# EAGLE design X16R60 (EAGLE 9.6.2)
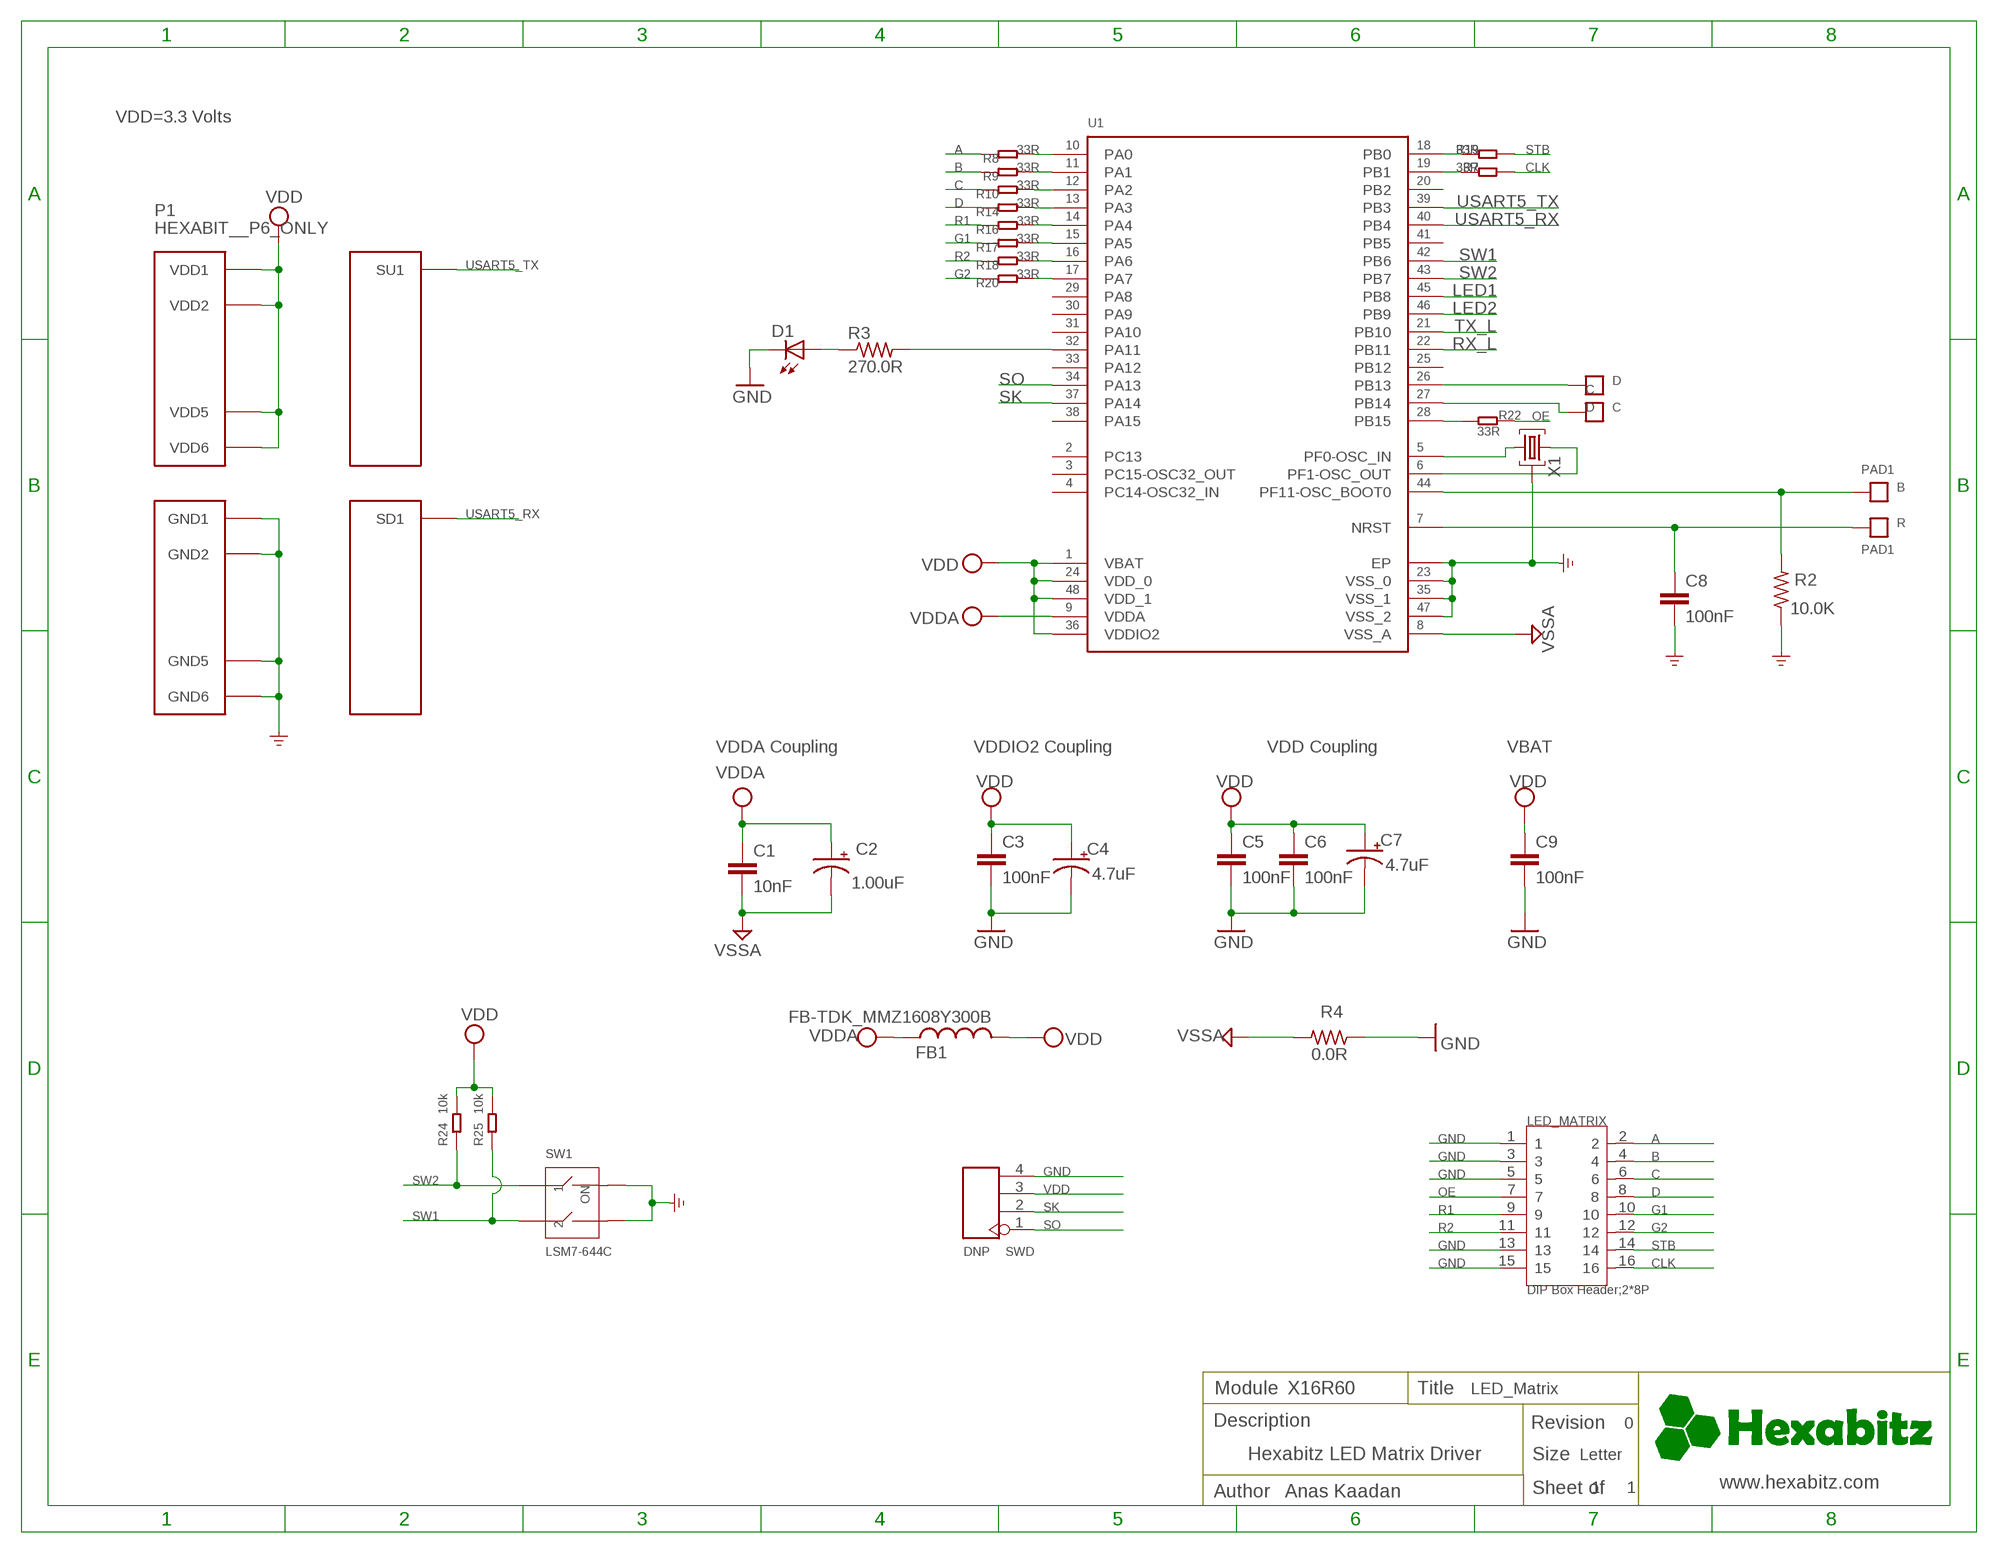
[diagram p0: schematic, sheet 1]

## Parts
B  PAD1  [PAD1]
C  C  PAD1  [PAD1]
C1  10nF  C-0603  [C-0603]
C2  1.00uF  C-0805-POL  [C-0805-POL]
C3  100nF  C-0603  [C-0603]
C4  4.7uF  C-0805-POL  [C-0805-POL]
C5  100nF  C-0603  [C-0603]
C6  100nF  C-0603  [C-0603]
C7  4.7uF  C-0805-POL  [C-0805-POL]
C8  100nF  C-0603  [C-0603]
C9  100nF  C-0603  [C-0603]
D  D  PAD1  [PAD1]
D1  VLMS1300-GS08  [VLMS1300-GS08]
FB1  FB-TDK_MMZ1608Y300B  [FB-TDK_MMZ1608Y300B]
LED_MATRIX  DIP Box Header;2*8P  HEADER-2X8P  [H2X8_2.54]
P1  HEXABIT__P6_ONLY  [HEXABIT_17.32_P6_ONLY]
R  PAD1  [PAD1]
R2  10.0K  R-0603  [R-0603]
R3  270.0R  R-0603  [R-0603]
R4  0.0R  R-0603  [R-0603]
R7  33R  RES-0402  [R0402]
R8  33R  RES-0402  [R0402]
R9  33R  RES-0402  [R0402]
R10  33R  RES-0402  [R0402]
R14  33R  RES-0402  [R0402]
R16  33R  RES-0402  [R0402]
R17  33R  RES-0402  [R0402]
R18  33R  RES-0402  [R0402]
R19  33R  RES-0402  [R0402]
R20  33R  RES-0402  [R0402]
R22  33R  RES-0402  [R0402]
R24  10k  RES-0402  [R0402]
R25  10k  RES-0402  [R0402]
SW1  LSM7-644C  SWITCHES-2X2P'KM-02'  [SW4-SMD-2.54-5.08X6.8X3.3MM]
SWD  DNP  HEADER-4P-65/35MIL  [H4-2.54]
U1  STM32F091CBU6  [STM32F091CBU6]
X1  XTALL_CSTCE8M00G52  [XTALL_CSTCE8M00G52]

## Nets
A: LED_MATRIX.2 R8.1
B: LED_MATRIX.4 R9.1
B1: B.P$1 B.P$2 R2.2 U1.P$44(PF11-OSC_BOOT0)
C: LED_MATRIX.6 R10.1
CLK: LED_MATRIX.16 R7.2
D: LED_MATRIX.8 R14.1
G1: LED_MATRIX.10 R17.1
G2: LED_MATRIX.12 R20.2
GND: C3.2 C4.2(-) C5.2 C6.2 C7.2(-) C8.2 C9.2 D1.C LED_MATRIX.1 LED_MATRIX.3 LED_MATRIX.5 LED_MATRIX.13 LED_MATRIX.15 P1.PAD_PD8(GND1) P1.PAD_PD9(GND2) P1.PAD_PD10(GND5) P1.PAD_PD11(GND6) R2.1 R4.1 SW1.3 SW1.4 SWD.4 U1.EP U1.P$23(VSS_0) U1.P$35(VSS_1) U1.P$47(VSS_2) X1.P$2 ; supply symbol labelled GND_POWER
LED1: U1.P$45(PB8)
LED2: U1.P$46(PB9)
N$1: U1.P$5(PF0-OSC_IN) X1.P$1
N$2: R14.2 U1.P$13(PA3)
N$3: R8.2 U1.P$10(PA0)
N$4: U1.P$6(PF1-OSC_OUT) X1.P$3
N$6: R16.2 U1.P$14(PA4)
N$7: R17.2 U1.P$15(PA5)
N$8: R18.2 U1.P$16(PA6)
N$9: R9.2 U1.P$11(PA1)
N$10: R10.2 U1.P$12(PA2)
N$11: R20.1 U1.P$17(PA7)
N$12: R19.1 U1.P$18(PB0)
N$14: D1.A R3.1
N$15: R22.1 U1.P$28(PB15)
N$16: R3.2 U1.P$32(PA11)
N$18: D.P$1 D.P$2 U1.P$26(PB13)
N$19: C.P$1 C.P$2 U1.P$27(PB14)
N$21: R7.1 U1.P$19(PB1)
OE: LED_MATRIX.7 R22.2
R1: LED_MATRIX.9 R16.1
R2: LED_MATRIX.11 R18.1
R3: C8.1 R.P$1 R.P$2 U1.P$7(NRST)
RX_L: U1.P$22(PB11)
SK: SWD.2 U1.P$37(PA14)
SO: SWD.1 U1.P$34(PA13)
STB: LED_MATRIX.14 R19.2
SW1: R25.1 SW1.2 U1.P$42(PB6)
SW2: R24.1 SW1.1 U1.P$43(PB7)
TX_L: U1.P$21(PB10)
USART5_RX: P1.PAD_PD3(SD1) U1.P$40(PB4)
USART5_TX: P1.PAD_PU3(SU1) U1.P$39(PB3)
VDD: C3.1 C4.1(+) C5.1 C6.1 C7.1(+) C9.1 FB1.2 P1.PAD_PU8(VDD1) P1.PAD_PU9(VDD2) P1.PAD_PU10(VDD5) P1.PAD_PU11(VDD6) R24.2 R25.2 SWD.3 U1.P$1(VBAT) U1.P$24(VDD_0) U1.P$36(VDDIO2) U1.P$48(VDD_1)
VDDA: C1.1 C2.1(+) FB1.1 U1.P$9(VDDA)
VSSA: C1.2 C2.2(-) R4.2 U1.P$8(VSS_A)
Unconnected: U1.P$2(PC13) U1.P$3(PC14-OSC32_IN) U1.P$4(PC15-OSC32_OUT) U1.P$20(PB2) U1.P$25(PB12) U1.P$29(PA8) U1.P$30(PA9) U1.P$31(PA10) U1.P$33(PA12) U1.P$38(PA15) U1.P$41(PB5)

## Notes on the sheet
- VDD=3.3 Volts
- VDDA Coupling | VDDIO2 Coupling | VDD Coupling | VBAT
- Module | X16R60 | Title | LED_Matrix
- Description | Revision | 0
- Hexabitz LED Matrix Driver
- Size | Letter
- 1 | 1 | www.hexabitz.com
- Author | Anas Kaadan | Sheet of

## Library data of the parts
B C D R = Hexabitz:PAD1
C1 = Hexabitz:C-0603: CAP CER 10% X7R 0603; CAPACITANCE: 10nF; MFN: KEMET; MPN: C0603C103K5RACTU; OCTOPART_URL: https://octopart.com/c0603c103k5ractu-kemet-133094?r=sp&s=R_iPBxLnSmGqhkU2rIMFpg; TOLERANCE: 10%; VOLTAGE_RATING: 50V
C2 = Hexabitz:C-0805-POL: Cap Tant Solid SMD 2012; CAPACITANCE: 1.00uF; MFN: Yageo; MPN: CC0805KKX7R7BB105; OCTOPART_URL: https://octopart.com/cc0805kkx7r7bb105-yageo-8376555?r=sp&s=YKl1wwtkROau_X5nniH2ig; TOLERANCE: 10%; VOLTAGE_RATING: 16V
C3 C6 C8 = Hexabitz:C-0603: CAP CER 10% X7R 0603; CAPACITANCE: 100nF; MFN: KEMET; MPN: C0603C104K8RACTU; OCTOPART_URL: https://octopart.com/c0603c104k8ractu-kemet-145075?r=sp&s=9bS9ASSwSEqMCE9KBEQZ0g; TOLERANCE: 10%; VOLTAGE_RATING: 10V
C4 C7 = Hexabitz:C-0805-POL: Cap Tant Solid SMD 2012; CAPACITANCE: 4.7uF; MFN: Murata; MPN: GRM21BC81E475KA12L; OCTOPART_URL: https://octopart.com/grm21bc81e475ka12l-murata-10331911?r=sp&s=RY3qZSD8T6mG6TC9CHI5qQ; TOLERANCE: 10%; VOLTAGE_RATING: 25V
C5 = Hexabitz:C-0603: CAP CER 10% X7R 0603; CAPACITANCE: 100nF; MFN: KEMET; MPN: C0603C104K8RACTU; OCTOPART_URL: https://octopart.com/c0603c104k8ractu-kemet-145075?r=sp&s=9bS9ASSwSEqMCE9KBEQZ0g; TOLERANCE: 10%; VOLTAGE_RATING: 10
C9 = Hexabitz:C-0603: CAP CER 10% X7R 0603; CAPACITANCE: 100nF; MFN: KEMET; MPN: C0603C104K8RACTU; OCTOPART_URL: https://octopart.com/c0603c104k8ractu-kemet-145075?r=sp&s=9bS9ASSwSEqMCE9KBEQZ0g; TOLERANCE: 10V; VOLTAGE_RATING: 10%
D1 = Hexabitz:VLMS1300-GS08: Red 0603 130° Clear 54 mcd 2 V Surface Mount ChipLED ; Octopart Url : http://octopart.com/vlms1300-gs08-vishay-21709201; MFN: Vishay; MPN: VLMS1300-GS08; OCTOPART_URL: https://octopart.com/vlms1300-gs08-vishay-21709201?r=sp&s=_gcP4_q8T1SC6PJQPTQ9yA
FB1 = Hexabitz:FB-TDK_MMZ1608Y300B: Ferrite Beads Multi-Layer 30Ohm 25% 100MHz 1.5A 50mOhm DCR 0603; MFN: TDK; MPN: MMZ1608Y300B; OCTOPART_URL: https://octopart.com/mmz1608y300b-tdk-368280?r=sp&s=cd9_2ZEqQ9q9UNBuQgHAiA
LED_MATRIX = Connector-new:HEADER-2X8P; DESCRIPTION: 2.54mm Straight 2X8p 16pin Box Header; MFN: ZYSZ Industry Co., Ltd; PART_URL: https://zyszconn.en.made-in-china.com/product/KjZQvOoUedkq/China-Factory-Supply-2-54mm-Straight-2X8p-16pin-Box-Header.html
P1 = hexabitz_connectors:HEXABIT_?_P6_ONLY: Hexabitz Hexagon Module Connector Hexagon side length = 17.32mm.
R2 = Hexabitz:R-0603: Thick Film Resistors - SMD 0603; MFN: Yageo; MPN: RC0603JR-0710KL; OCTOPART_URL: https://octopart.com/search?q=RC0603JR-0710KL&start=0; RESISTANCE: 10.0K Ohm; TOLERANCE: 5%
R3 = Hexabitz:R-0603: Thick Film Resistors - SMD 0603; MFN: Yageo; MPN: RC0603FR-07270RL; OCTOPART_URL: https://octopart.com/search?q=RC0603FR-07270RL&start=0; RESISTANCE: 270.0 Ohm; TOLERANCE: 1%
R4 = Hexabitz:R-0603: Thick Film Resistors - SMD 0603; MFN: Yageo; MPN: RC0603JR-070RL; OCTOPART_URL: https://octopart.com/rc0603jr-070rl-yageo-1241539?r=sp&s=X2NteqRjRNWrnx42Y0aliA; RESISTANCE: 0.0 Ohm
R7-R10 R14 R16-R19 R22 = Discrete-new:RES; DESCRIPTION: Res Thick Film 0402 33 Ohm 1% 0.063W(1/16W) ±100ppm/C Pad SMD Automotive T/R; MFN: Yageo; MPN: AC0402FR-0733RL; OCTOPART_URL: https://octopart.com/ac0402fr-0733rl-yageo-24618175?r=sp
R20 = Discrete-new:RES; DESCROPTION: Res Thick Film 0402 33 Ohm 1% 0.063W(1/16W) ±100ppm/C Pad SMD Automotive T/R; MFN: Yageo; MPN: AC0402FR-0733RL; OCTOPART_URL: https://octopart.com/ac0402fr-0733rl-yageo-24618175?r=sp
R24 = Discrete-new:RES; DESCRITION: General Purpose Chip Resistor Thick Film 0402 510kOhm 1% Paper T/R; MFN: Yageo; MPN: RC0402FR-07510KL; OCTOPART_URL: https://octopart.com/rc0402fr-07510kl-yageo-39852933?r=sp
R25 = Discrete-new:RES; DESCRIPTION: General Purpose Chip Resistor Thick Film 0402 510kOhm 1% Paper T/R; MFN: Yageo; MPN: RC0402FR-07510KL; OCTOPART_URL: https://octopart.com/rc0402fr-07510kl-yageo-39852933?r=sp
SW1 = Discrete-new:SWITCHES-2X2P; DESCRIPTION: Switch DIP OFF ON SPST 2 Raised Slide 0.025A 24VDC Gull Wing 2.54mm SMD T/R; MFN: E-Switch; MPN: KAE02LGGR; OCTOPART_URL: https://octopart.com/kae02lggr-e-switch-24959047?r=sp
SWD = Connector-new:HEADER-4P
U1 = HEXABITZ_ICs:STM32F091CBU6: Description : ARM-based 32-bit MCU, CAN, 12 timers, ADC, DAC & Comm. Interface, 2 to 3.6 V, -40 to 85 degC, 48-Pin UFQFPN, RoHS, Tray ;Parameter : Ciiva URL : https://ciiva.com/part/STM32F091CBU6-20240708, CiivaID : 20240708, Clock Speed : 48000000.0 Hz, Lifecycle Status : Active, Mounting Style : Surface Mount, Number of Pins : 48, Octopart Url : https://octopart.com/stm32f091cbu6-stmicroelectronics-51988677, OctopartID : 5f4f955c32ec8088, RAM Memory Size : 32768 B, REACH SVHC Compliance : No SVHC, RoHS : Compliant,; MFN: STMicroelectronics; MPN: STM32F091CBU6; OCTOPART_URL: https://octopart.com/stm32f091cbu6-stmicroelectronics-51988677?r=sp&s=bU6fpgsrTZOxHyt7jkfh3w
X1 = HEXABITZ_OTHER_PARTS:XTALL_CSTCE8M00G52: MURATA CSTCE8M00G52-R0 RESONATOR, SMD, 8MHZ ; Octopart Url : https://octopart.com/cstce8m00g52-r0-murata-7145559; MFN: Murata; MPN: CSTCE8M00G52Z-R0; OCTOPART_URL: https://octopart.com/cstce8m00g52z-r0-murata-17755941?r=sp&s=JDnNJnrHQhyS8Zk4ofFWXw

## Board
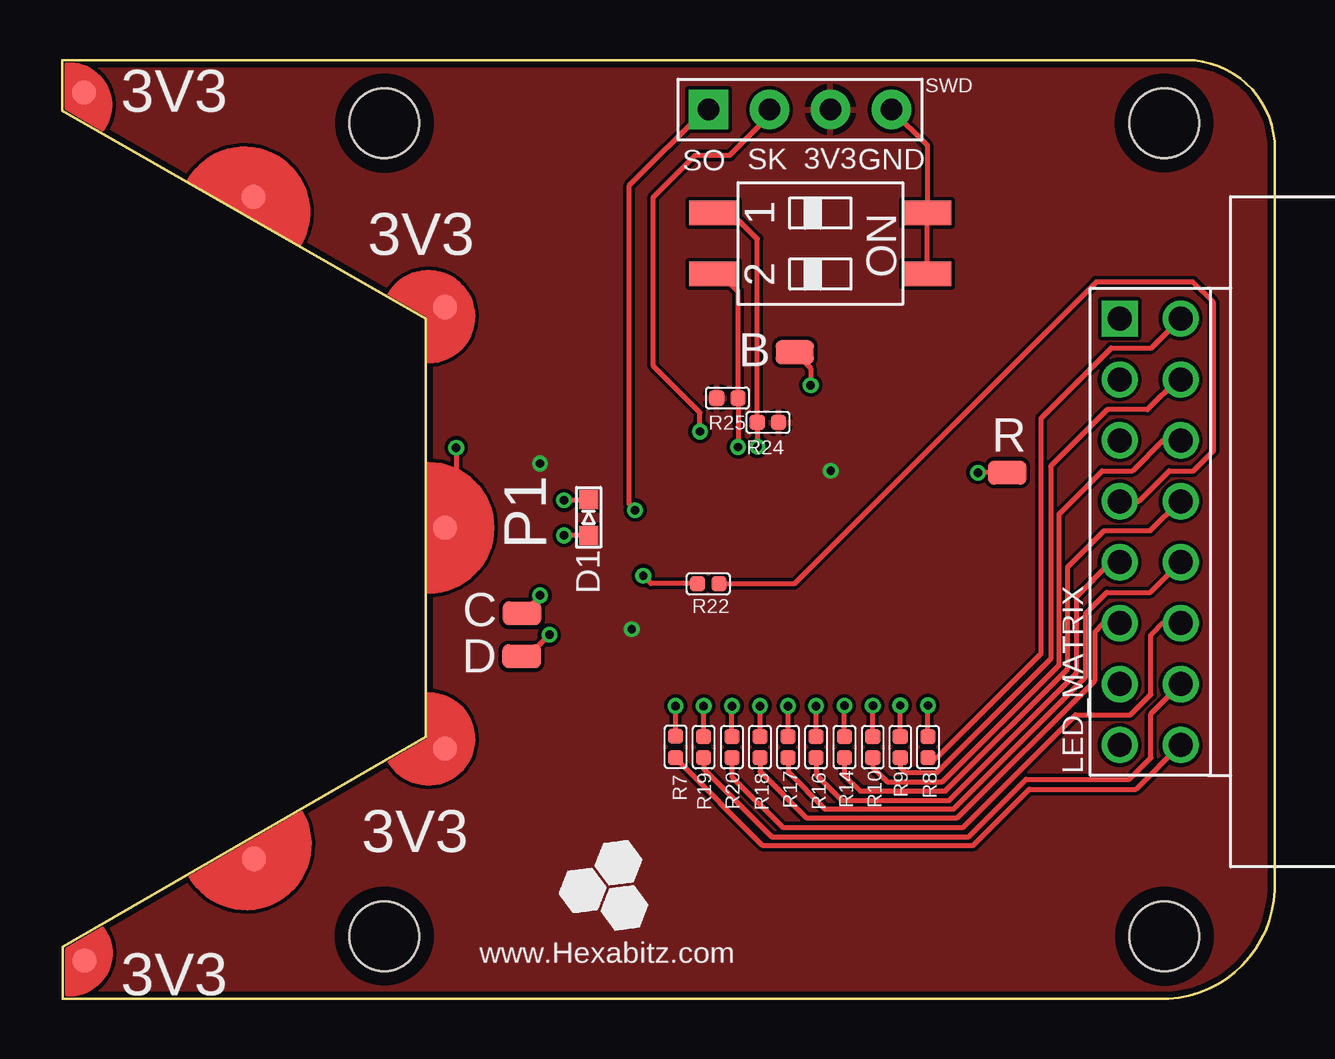
[diagram p1: board, top side]
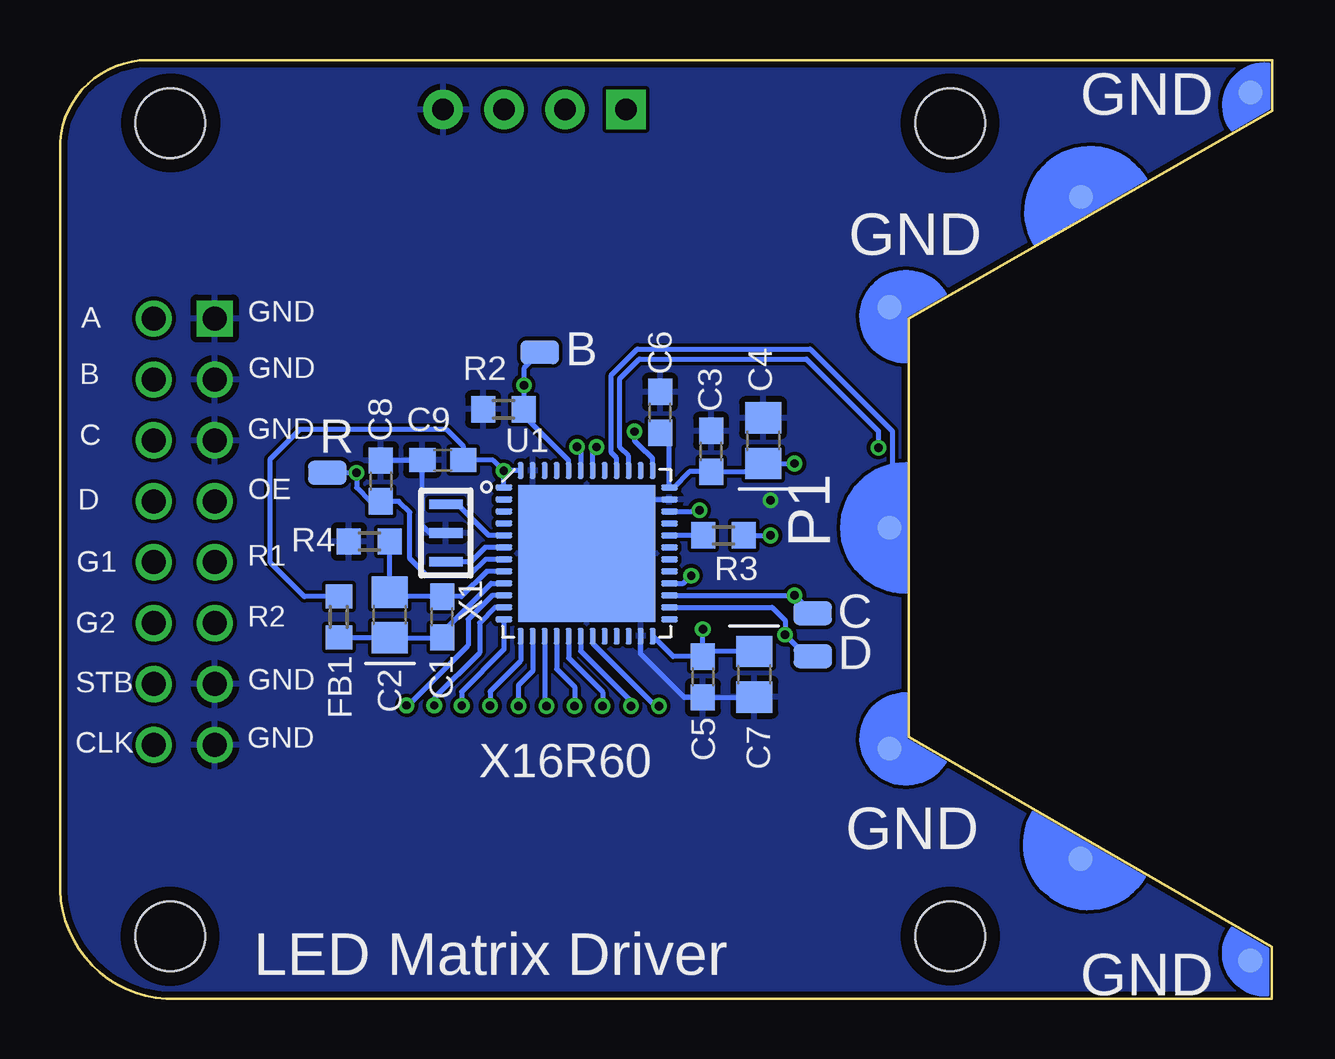
[diagram p2: board, bottom side, seen from below]

Size 50.51 x 39.14 mm. Coordinates in mm from the lower left corner, seen from the top.
Copper layers (1*16): Top 0.035mm / dielectric 1.5mm / Bottom 0.035mm
Design rules "SeeedStudio_2layer_DRU_no_angle_20140221 *": minimum track width 6mil, minimum drill 10mil, track to track 6mil, track to pad 6mil, pad to pad 6mil, via to via 6mil, smd to smd 0mil, copper to edge 10mil, drill to drill 10mil, minimum pad ring 10mil, minimum via ring 6mil, stop-mask expansion 2mil, vias tented up to drill 25mil, thermal gap 10mil
Holes 2.9 mm at 13.41,36.51 13.41,2.6 45.92,2.6 45.92,36.51
tRestrict: area 11.6,34.7 to 15.3,38.3; area 11.6,0.8 to 15.2,4.5; area 44.1,34.7 to 47.7,38.3; area 44.1,0.8 to 47.8,4.4
bRestrict: area 11.6,34.7 to 15.3,38.3; area 11.6,0.8 to 15.2,4.5; area 44.1,34.7 to 47.7,38.3; area 44.1,0.8 to 47.8,4.4

### Footprints (pad centres in the part's own frame; a part is rotated, then mirrored left to right if it is on the bottom)
PAD1 = smd 1.6 x 1: P$1 0,0 | smd 1.6 x 1 bottom: P$2 0,0
C-0603 = smd 1.1 x 1: 1 -0.85,0; 2 0.85,0
C-0805-POL = smd 1.3 x 1.5: 1 -0.95,0; 2 0.95,0
VLMS1300-GS08 = smd 0.8 x 0.8: A 0,0.75; C 0,-0.75
FB-TDK_MMZ1608Y300B = smd 1 x 1.1: 1 -0.85,0; 2 0.85,0
H2X8_2.54 = drill 1 square: 1 -1.27,8.89 | drill 1: 2 1.27,8.89; 3 -1.27,6.35; 4 1.27,6.35; 5 -1.27,3.81; 6 1.27,3.81; 7 -1.27,1.27; 8 1.27,1.27; 9 -1.27,-1.27; 10 1.27,-1.27; 11 -1.27,-3.81; 12 1.27,-3.81; 13 -1.27,-6.35; 14 1.27,-6.35; 15 -1.27,-8.89; 16 1.27,-8.89
HEXABIT_17.32_P6_ONLY = smd 1 x 1 bottom: PAD_PD2 -13.011,14.245; PAD_PD3 -5.034,0.445; PAD_PD4 -12.991,-13.355; PAD_PD8 -20.079,18.59; PAD_PD9 -5.034,9.645; PAD_PD10 -5.034,-8.755; PAD_PD11 -20.066,-17.587 | smd 1 x 1: PAD_PU2 -13.011,14.245; PAD_PU3 -5.034,0.445; PAD_PU4 -12.991,-13.355; PAD_PU8 -20.079,18.59; PAD_PU9 -5.034,9.645; PAD_PU10 -5.034,-8.755; PAD_PU11 -20.066,-17.587
R-0603 = smd 1 x 1.1: 1 -0.85,0; 2 0.85,0
R0402 = smd 0.635 x 0.635: 1 0,0.445; 2 0,-0.445
SW4-SMD-2.54-5.08X6.8X3.3MM = smd 1.016 x 2.032: 1 -1.27,-4.445; 2 1.27,-4.445; 3 1.27,4.445; 4 -1.27,4.445
H4-2.54 = drill 0.889 pad 1.651 square: 1 0,3.81 | drill 0.889 pad 1.651: 2 0,1.27; 3 0,-1.27; 4 0,-3.81
STM32F091CBU6 = smd 5.7 x 5.7: EP 0,0 | smd 0.25 x 0.7: P$1 -2.75,-3.45; P$2 -2.25,-3.45; P$3 -1.75,-3.45; P$4 -1.25,-3.45; P$5 -0.75,-3.45; P$6 -0.25,-3.45; P$7 0.25,-3.45; P$8 0.75,-3.45; P$9 1.25,-3.45; P$10 1.75,-3.45; P$11 2.25,-3.45; P$12 2.75,-3.45; P$25 2.75,3.45; P$26 2.25,3.45; P$27 1.75,3.45; P$28 1.25,3.45; P$29 0.75,3.45; P$30 0.25,3.45; P$31 -0.25,3.45; P$32 -0.75,3.45; P$33 -1.25,3.45; P$34 -1.75,3.45; P$35 -2.25,3.45; P$36 -2.75,3.45 | smd 0.7 x 0.25: P$13 3.45,-2.75; P$14 3.45,-2.25; P$15 3.45,-1.75; P$16 3.45,-1.25; P$17 3.45,-0.75; P$18 3.45,-0.25; P$19 3.45,0.25; P$20 3.45,0.75; P$21 3.45,1.25; P$22 3.45,1.75; P$23 3.45,2.25; P$24 3.45,2.75; P$37 -3.45,2.75; P$38 -3.45,2.25; P$39 -3.45,1.75; P$40 -3.45,1.25; P$41 -3.45,0.75; P$42 -3.45,0.25; P$43 -3.45,-0.25; P$44 -3.45,-0.75; P$45 -3.45,-1.25; P$46 -3.45,-1.75; P$47 -3.45,-2.25; P$48 -3.45,-2.75
XTALL_CSTCE8M00G52 = smd 1.4 x 0.4: P$1 0,1.2; P$2 0,0; P$3 0,-1.2

### Placement (x,y rotation side)
B  30.52,26.96 0 top
C  19.15,16.07 180 bottom
C1  34.58,15.92 90 bottom
C2  36.77,16.01 90 bottom
C3  23.38,22.83 90 bottom
C4  21.21,23.27 90 bottom
C5  23.72,13.42 270 bottom
C6  25.5,24.45 90 bottom
C7  21.58,13.53 270 bottom
C8  37.13,21.6 90 bottom
C9  34.56,22.46 180 bottom
D  19.14,14.28 180 bottom
D1  21.93,20.07 180 top
FB1  38.89,15.92 90 bottom
LED_MATRIX  45.33,19.48 0 top
P1  20.98,19.2 0 top
R  39.37,21.94 0 bottom
R2  32.03,24.58 0 bottom
R3  22.86,19.32 180 bottom
R4  37.62,19.07 0 bottom
R7  25.55,10.51 0 top
R8  36.07,10.5 180 top
R9  34.91,10.5 180 top
R10  33.77,10.5 180 top
R14  32.59,10.5 180 top
R16  31.41,10.5 180 top
R17  30.24,10.5 180 top
R18  29.07,10.5 180 top
R19  26.72,10.5 0 top
R20  27.9,10.5 0 top
R22  26.91,17.3 90 top
R24  29.4,24.04 90 top
R25  27.71,25.05 270 top
SW1  31.58,31.49 270 top
SWD  30.73,37.08 90 top
U1  28.56,18.57 270 bottom
X1  34.43,19.42 0 bottom

### Tracks (layer width: path | path; a pad name or v marks a point on that pad's centre or on a via)
A
  Top 0.203: LED_MATRIX.2 45.36,27.13 43.7,27.13 40.78,24.21 40.78,14.41 36.42,10.05 R8.1
B
  Top 0.203: R9.1 34.91,9.66 35.13,9.44 36.45,9.44 41.17,14.17 41.17,22.21 43.54,24.57 45.21,24.57 46.47,25.83 LED_MATRIX.4
B1  (via drill 0.35)
  Top 0.203: B.P$2 31.18,26.29 v31.18,25.58
  Bottom 0.203: U1.P$44 29.31,22.45 31.18,24.32 R2.2 v31.18,25.58 31.18,26.29 B.P$2
C
  Top 0.203: R10.1 33.77,9.65 34.37,9.05 36.66,9.05 41.53,13.92 41.53,20.23 43.32,22.02 44.59,22.02 45.86,23.29 LED_MATRIX.6
CLK
  Top 0.203: R7.2 25.55,10.03 29.17,6.41 37.96,6.41 40.3,8.74 44.74,8.74 46.58,10.59 LED_MATRIX.16
D
  Top 0.203: R14.1 32.59,9.32 33.24,8.67 36.79,8.67 41.88,13.76 41.88,18 43.41,19.53 45.34,19.53 46.56,20.75 LED_MATRIX.8
G1
  Top 0.203: R17.1 30.24,9.46 31.78,7.92 37.13,7.92 42.63,13.42 42.63,16.06 43.52,16.95 45.34,16.95 LED_MATRIX.10
G2
  Top 0.203: R20.2 27.9,9.27 30.01,7.16 37.53,7.16 42.21,11.84 44.5,11.84 45.35,12.69 45.35,15.18 45.83,15.67 LED_MATRIX.12
GND  (via drill 0.35)
  Top 0.203: D1.C 21.89,20.78 v20.9,20.78 | SW1.3 SW1.4 36.03,35.59 SWD.4
  Bottom 0.203: C9.2 35.42,22.45 | 35.42,22.45 C8.2 | X1.P$2 35.1,19.43 35.42,19.74 35.42,22.45 | U1.P$23 26.31,14.38 24.5,12.57 C5.2 21.59,12.57 C7.2 | U1.EP 26.31,20.82 U1.P$35
  pour Bottom (isolate 0.152): 0.14,2.09 0.14,0.15 45.17,0.15 arc90 50.34,4.22 50.34,35.91 arc90 46.66,39.01 0.22,39.01 0.22,37.14 15.29,28.44 15.29,10.83
N$1
  Bottom 0.203: U1.P$5 32.65,19.32 33.95,20.63 X1.P$1
N$2  (via drill 0.35)
  Top 0.203: R14.2 v32.59,12.22
  Bottom 0.203: U1.P$13 31.31,14.1 32.59,12.82 v32.59,12.22
N$3  (via drill 0.35)
  Top 0.203: R8.2 v36.07,12.24
  Bottom 0.203: U1.P$10 32.5,16.82 33.5,15.82 33.5,14.74 36.01,12.24 v36.07,12.24
N$4
  Bottom 0.203: U1.P$6 32.8,18.82 33.39,18.23 X1.P$3
N$6  (via drill 0.35)
  Top 0.203: R16.2 v31.41,12.21
  Bottom 0.203: U1.P$14 30.81,13.68 31.41,13.08 v31.41,12.21
N$7  (via drill 0.35)
  Top 0.203: R17.2 v30.24,12.21
  Bottom 0.203: U1.P$15 30.31,12.29 v30.24,12.21
N$8  (via drill 0.35)
  Top 0.203: R18.2 v29.07,12.21
  Bottom 0.203: U1.P$16 29.81,13.75 29.07,13.01 v29.07,12.21
N$9  (via drill 0.35)
  Top 0.203: R9.2 v34.91,12.24
  Bottom 0.203: U1.P$11 32.39,16.32 33.03,15.68 33.03,14.43 34.91,12.55 v34.91,12.24
N$10  (via drill 0.35)
  Top 0.203: R10.2 v33.77,12.22
  Bottom 0.203: U1.P$12 32.01,14.56 33.77,12.81 v33.77,12.22
N$11  (via drill 0.35)
  Top 0.203: R20.1 v27.9,12.21
  Bottom 0.203: U1.P$17 29.31,14.21 27.9,12.8 v27.9,12.21
N$12  (via drill 0.35)
  Top 0.203: R19.1 v26.72,12.21
  Bottom 0.203: U1.P$18 28.81,14.51 26.72,12.41 v26.72,12.21
N$14  (via drill 0.35)
  Top 0.203: D1.A v20.91,19.32 v20.9,19.32
  Bottom 0.203: R3.1 v20.9,19.32
N$15  (via drill 0.35)
  Top 0.203: v24.21,17.65 24.54,17.32 26.45,17.32 R22.1
  Bottom 0.203: U1.P$28 24.53,17.32 v24.21,17.65
N$16
  Bottom 0.203: R3.2 U1.P$32
N$18  (via drill 0.35)
  Top 0.203: D.P$1 19.39,14.28 v20.29,15.18
  Bottom 0.203: U1.P$26 20.84,16.32 20.29,15.78 v20.29,15.18 19.39,14.28 D.P$1
N$19  (via drill 0.35)
  Top 0.203: C.P$1 v19.9,16.82
  Bottom 0.203: U1.P$27 v19.9,16.82 C.P$1
N$21  (via drill 0.35)
  Top 0.203: R7.1 v25.55,12.21
  Bottom 0.203: v25.55,12.21 25.7,12.21 28.31,14.83 U1.P$19
OE
  Top 0.203: LED_MATRIX.7 44.84,20.75 46.11,22.02 47.13,22.02 47.97,22.85 47.97,29.03 47.1,29.89 43.08,29.89 30.49,17.3 R22.2
R1
  Top 0.203: R16.1 31.41,9.34 32.47,8.27 36.94,8.27 42.27,13.6 42.27,16.78 43.69,18.21 LED_MATRIX.9
R2
  Top 0.203: R18.1 29.07,9.48 31,7.55 37.3,7.55 43.03,13.28 43.03,15.3 43.4,15.67 LED_MATRIX.11
R3  (via drill 0.35)
  Top 0.203: R.P$2 v38.15,21.94
  Bottom 0.203: U1.P$7 32.77,18.32 33.45,17.64 35.22,17.64 35.93,18.35 35.93,20.29 36.39,20.75 C8.1 37.58,20.75 38.15,21.32 v38.15,21.94 R.P$2
SK  (via drill 0.35)
  Top 0.203: v26.57,23.65 26.57,24.44 24.63,26.38 24.63,33.43 26.37,35.17 27.81,35.17 29.46,36.82 SWD.2
  Bottom 0.203: U1.P$37 25.81,22.53 26.08,22.8 26.11,22.8 26.57,23.26 v26.57,23.65
SO  (via drill 0.35)
  Top 0.203: v23.86,20.38 23.62,20.62 23.62,33.92 26.78,37.08 SWD.1
  Bottom 0.203: U1.P$34 23.92,20.32 v23.86,20.38
STB
  Top 0.203: R19.2 26.72,9.6 29.55,6.76 37.76,6.76 40.16,9.16 44.46,9.16 45.35,10.05 45.35,11.88 LED_MATRIX.14
SW1  (via drill 0.35)
  Top 0.203: v28.16,23.01 R25.1 28.16,29.5 27.43,30.22 SW1.2
  Bottom 0.203: U1.P$42 28.31,22.85 v28.16,23.01
SW2  (via drill 0.35)
  Top 0.203: v28.96,23.02 R24.1 28.96,31.68 27.88,32.76 SW1.1
  Bottom 0.203: U1.P$43 28.81,22.87 v28.96,23.02
USART5_RX
  Bottom 0.203: U1.P$40 27.31,22.55 27.53,22.77 27.53,26.01 26.45,27.1 19.25,27.1 15.83,23.67 15.83,19.76 P1.PAD_PD3
USART5_TX  (via drill 0.35)
  Top 0.203: v16.41,22.98 16.41,20.1 P1.PAD_PU3
  Bottom 0.203: U1.P$39 26.81,22.63 27.18,22.99 27.18,25.86 26.37,26.68 19.41,26.68 16.41,23.68 v16.41,22.98
VDD  (via drill 0.35)
  Bottom 0.203: C5.1 24.96,14.27 U1.P$24 | C7.1 23.51,14.48 C5.1 | FB1.2 40.32,16.77 41.76,18.2 41.76,22.5 40.5,23.76 34.42,23.76 33.71,23.05 C9.1 32.46,22.46 v32.02,22.02 v32.01,22.01 | C6.1 25.11,23.21 U1.P$36 24.94,21.32 24.28,21.98 C3.1 21.55,21.98 C4.1 v19.9,22.32 | U1.P$1 v32.01,22.01 | U1.P$48 32,22.02 v32.01,22.01 | C5.1 v23.72,15.41
  pour Top (isolate 0.152): 45.08,0.13 0.14,0.13 0.14,2.08 15.27,10.82 15.27,28.44 0.19,37.15 0.19,39.01 46.5,39.01 arc-90 50.34,35.78 50.34,4.27 arc-90
VDDA
  Bottom 0.203: U1.P$9 32.54,17.32 34.58,15.29 C1.1 34.59,15.06 C2.1 FB1.1
VSSA
  Bottom 0.203: U1.P$8 32.73,17.82 33.78,16.77 C1.2 36.58,16.77 C2.2 R4.2

### Text on the board
tPlace: SO | SK | 3V3 | GND | www.Hexabitz.com
bPlace: GND | A | GND | B | GND | C | OE | D | R1 | G1 | R2 | G2 | GND | STB | GND | CLK | X16R60 | LED Matrix Driver
tNames: 3V3 | 3V3 | R | P1 | 3V3 | 3V3
bNames: GND | GND | B | P1 | GND | GND